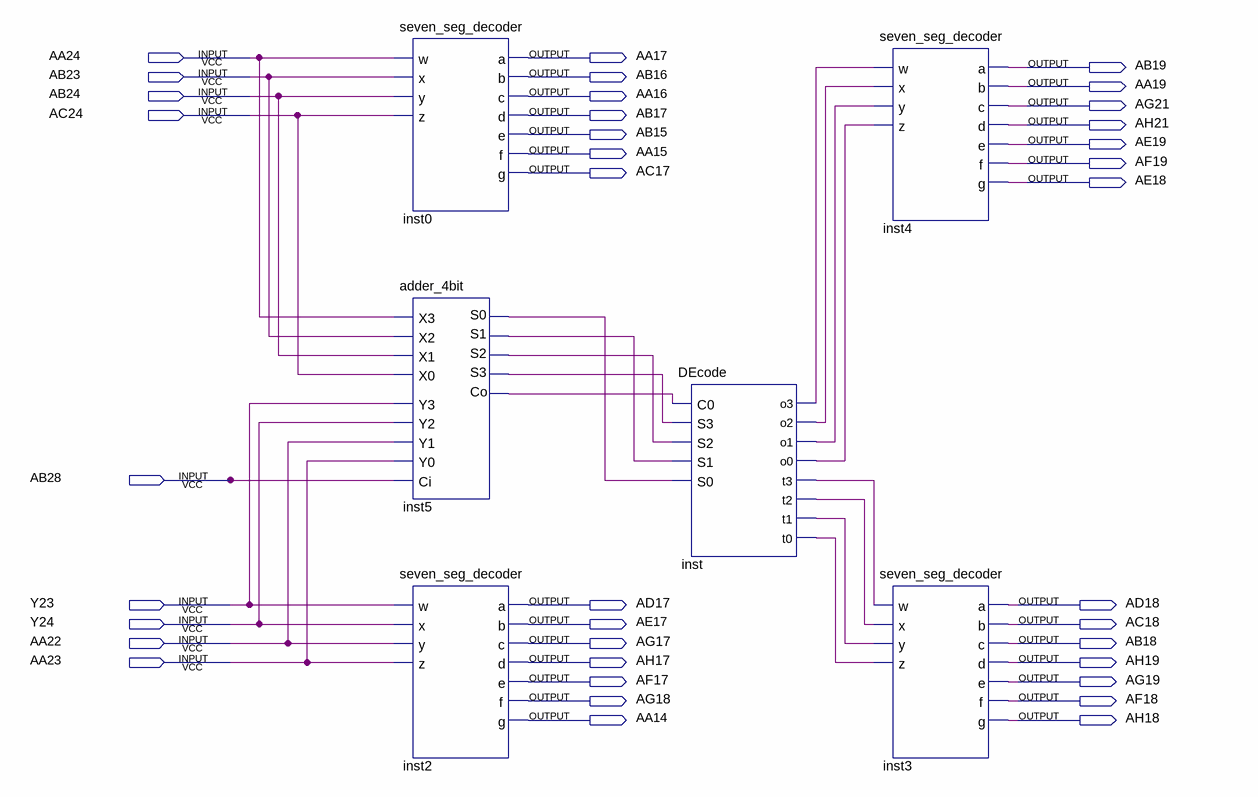
[diagram p0: schematic sheet]
// Quartus schematic lab6step0.bdf as structural Verilog: 6 symbols, 37 pins
module lab6step0 (
  input  AA24,
  input  AB23,
  input  AB24,
  input  AC24,
  input  AB28,
  input  Y23,
  input  Y24,
  input  AA22,
  input  AA23,
  output AA17,
  output AB19,
  output AB16,
  output AA19,
  output AA16,
  output AG21,
  output AB17,
  output AH21,
  output AB15,
  output AE19,
  output AA15,
  output AF19,
  output AC17,
  output AE18,
  output AD17,
  output AD18,
  output AE17,
  output AC18,
  output AG17,
  output AB18,
  output AH17,
  output AH19,
  output AF17,
  output AG19,
  output AG18,
  output AF18,
  output AA14,
  output AH18
);

  wire inst5_co, inst5_s0, inst5_s1, inst5_s2, inst5_s3, inst_o0, inst_o1, inst_o2, inst_o3, inst_t0,
       inst_t1, inst_t2, inst_t3;

  seven_seg_decoder inst0 (
    .w(AA24), .x(AB23), .y(AB24), .z(AC24), .a(AA17), .b(AB16), .c(AA16), .d(AB17), .e(AB15), .f(AA15),
    .g(AC17));
  adder_4bit inst5 (
    .X3(AA24), .Y3(Y23), .X2(AB23), .Y2(Y24), .X1(AB24), .Y1(AA22), .X0(AC24), .Y0(AA23), .Ci(AB28),
    .S0(inst5_s0), .S1(inst5_s1), .S2(inst5_s2), .S3(inst5_s3), .Co(inst5_co));
  seven_seg_decoder inst2 (
    .w(Y23), .x(Y24), .y(AA22), .z(AA23), .a(AD17), .b(AE17), .c(AG17), .d(AH17), .e(AF17), .f(AG18), .g(AA14));
  DEcode inst (
    .C0(inst5_co), .S3(inst5_s3), .S2(inst5_s2), .S1(inst5_s1), .S0(inst5_s0), .o3(inst_o3), .o2(inst_o2),
    .o1(inst_o1), .o0(inst_o0), .t3(inst_t3), .t2(inst_t2), .t1(inst_t1), .t0(inst_t0));
  seven_seg_decoder inst4 (
    .w(inst_o3), .x(inst_o2), .y(inst_o1), .z(inst_o0), .a(AB19), .b(AA19), .c(AG21), .d(AH21), .e(AE19),
    .f(AF19), .g(AE18));
  seven_seg_decoder inst3 (
    .w(inst_t3), .x(inst_t2), .y(inst_t1), .z(inst_t0), .a(AD18), .b(AC18), .c(AB18), .d(AH19), .e(AG19),
    .f(AF18), .g(AH18));
endmodule
